# EAGLE schematic nano (EAGLE 9.5.2)
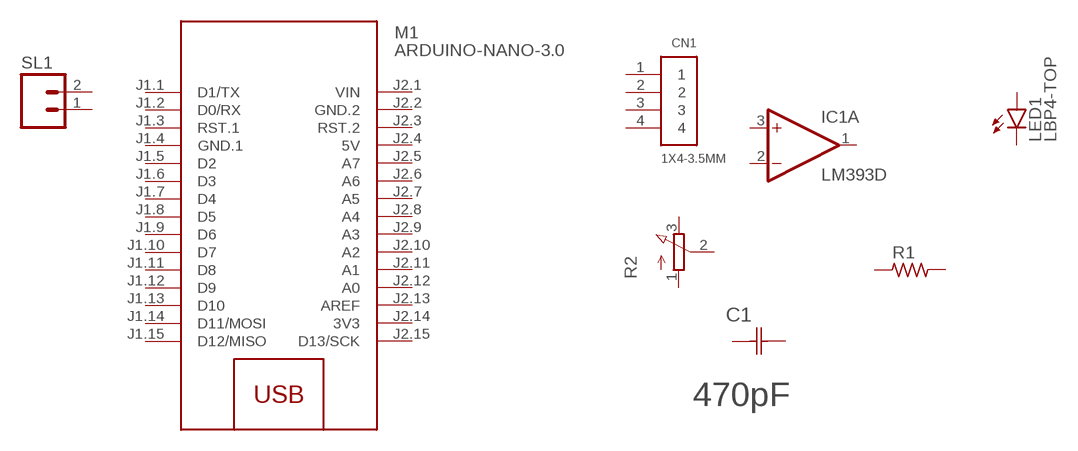
[diagram p0: schematic, sheet 1]

## Parts
C1  470pF  C0603C471J5GACTU  [CAPC1608X85N]
CN1  1X4-3.5MM  [1X04-3.5MM]
IC1  LM393D  [SO08]
LED1  LBP4-TOP  [P47F-TOP]
M1  ARDUINO-NANO-3.0  [ARDUINO-NANO-3.0]
R1  R_0603  [R0603]
R2  3RP/1610N  [3RP/1610N]
SL1  M02  [02P]
Unconnected: C1.1(C1) C1.2(C2) CN1.1 CN1.2 CN1.3 CN1.4 IC1.1(A:OUT) IC1.2(A:-IN) IC1.3(A:+IN) IC1.5(B:+IN) IC1.6(B:-IN) IC1.7(B:OUT) LED1.A LED1.C M1.J1.1(D1/TX) M1.J1.2(D0/RX) M1.J1.3(RST.1) M1.J1.5(D2) M1.J1.6(D3) M1.J1.7(D4) M1.J1.8(D5) M1.J1.9(D6) M1.J1.10(D7) M1.J1.11(D8) M1.J1.12(D9) M1.J1.13(D10) M1.J1.14(D11/MOSI) M1.J1.15(D12/MISO) M1.J2.3(RST.2) M1.J2.5(A7) M1.J2.6(A6) M1.J2.7(A5) M1.J2.8(A4) M1.J2.9(A3) M1.J2.10(A2) M1.J2.11(A1) M1.J2.12(A0) M1.J2.13(AREF) M1.J2.15(D13/SCK) R1.1 R1.2 R2.1(A) R2.2(S) R2.3(E) SL1.1 SL1.2

## Power pins joined to a net without a drawn wire
3V3: M1.J2.14(3V3)
5V: M1.J2.4(5V)
GND.1: M1.J1.4(GND.1)
GND.2: M1.J2.2(GND.2)
V+: IC1.8(P:V+)
V-: IC1.4(P:V-)
VIN: M1.J2.1(VIN)

## Library data of the parts
C1 = Kemet_By_element14_Batch_1:C0603C471J5GACTU: CAPACITOR, 0603; MPN: C0603C471J5GACTU; OC_FARNELL: 1414640; OC_NEWARK: 85C0270; SUPPLIER: Kemet; TOLERANCE: ±5%; VOLTAGERATING: 50V
CN1 = adafruit:1X4: 4-pin connector
IC1 = linear:LM393: COMPARATOR
LED1 = led:*P4: PointLED® Enhanced Thinfilm LED TOP & BOTTOM mount LS P47F, LR P47F, LA P47F, LY P47F, LT P4SG, LB P4SG, LW P4SG Source: http://catalog.osram-os.com .. LA_LR_LS_LY_P47F_Pb_free.pdf
M1 = diy-modules:ARDUINO-NANO-3.0: Arduino Nano 3.0
R1 = cap_master-smd:R_: RESISTOR
R2 = pot:3RP/1610N: 16mm Potentiometer one level Source: http://www.alphapotentiometers.net/html/16mm_pot_2.html
SL1 = con-amp-quick:M02: AMP QUICK CONNECTOR; OC_FARNELL: unknown; OC_NEWARK: unknown